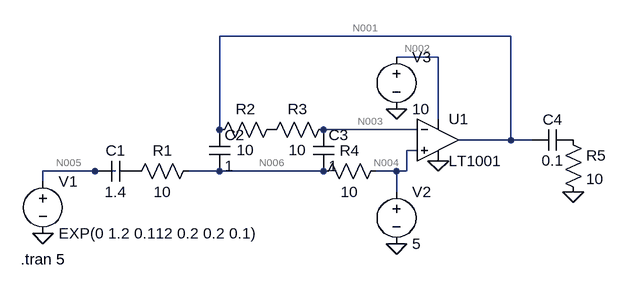
[diagram p0: schematic neural pulse very_close_approx_!_1009.asc]
neural pulse very_close_approx_!_1009.asc, the LTspice schematic file:
Version 4
SHEET 1 880 680
WIRE 432 -128 -16 -128
WIRE 320 -96 256 -96
WIRE 320 0 320 -96
WIRE -16 16 -16 -128
WIRE 288 16 144 16
WIRE 432 32 432 -128
WIRE 432 32 352 32
WIRE 464 32 432 32
WIRE 288 48 272 48
WIRE -208 80 -288 80
WIRE -176 80 -208 80
WIRE -16 80 -64 80
WIRE 144 80 -16 80
WIRE 256 80 224 80
WIRE 272 80 272 48
WIRE 272 80 256 80
WIRE -288 96 -288 80
WIRE 256 112 256 80
FLAG -288 176 0
FLAG 256 192 0
FLAG 320 64 0
FLAG 256 -16 0
FLAG 528 112 0
SYMBOL voltage -288 80 R0
WINDOW 123 0 0 Left 2
WINDOW 39 0 0 Left 2
SYMATTR InstName V1
SYMATTR Value EXP(0 1.2 0.112 0.2 0.2 0.1)
SYMBOL cap -144 64 R90
WINDOW 0 0 32 VBottom 2
WINDOW 3 32 32 VTop 2
SYMATTR InstName C1
SYMATTR Value 1.4
SYMBOL res -48 64 R90
WINDOW 0 0 56 VBottom 2
WINDOW 3 32 56 VTop 2
SYMATTR InstName R1
SYMATTR Value 10
SYMBOL cap -32 16 R0
SYMATTR InstName C2
SYMATTR Value 1
SYMBOL res 80 0 R90
WINDOW 0 0 56 VBottom 2
WINDOW 3 32 56 VTop 2
SYMATTR InstName R2
SYMATTR Value 10
SYMBOL res 160 0 R90
WINDOW 0 0 56 VBottom 2
WINDOW 3 32 56 VTop 2
SYMATTR InstName R3
SYMATTR Value 10
SYMBOL cap 128 16 R0
SYMATTR InstName C3
SYMATTR Value 1
SYMBOL res 240 64 R90
WINDOW 0 0 56 VBottom 2
WINDOW 3 32 56 VTop 2
SYMATTR InstName R4
SYMATTR Value 10
SYMBOL voltage 256 96 R0
WINDOW 123 0 0 Left 2
WINDOW 39 0 0 Left 2
SYMATTR InstName V2
SYMATTR Value 5
SYMBOL Opamps\\LT1001 320 -32 R0
SYMATTR InstName U1
SYMBOL voltage 256 -112 R0
WINDOW 123 0 0 Left 2
WINDOW 39 0 0 Left 2
SYMATTR InstName V3
SYMATTR Value 10
SYMBOL cap 528 16 R90
WINDOW 0 0 32 VBottom 2
WINDOW 3 32 32 VTop 2
SYMATTR InstName C4
SYMATTR Value 0.1
SYMBOL res 512 16 R0
SYMATTR InstName R5
SYMATTR Value 10
TEXT -322 216 Left 2 !.tran 5

The netlist it stands for:
* neural pulse very_close_approx_!_1009.asc
V1 N005 0 EXP(0 1.2 0.112 0.2 0.2 0.1)
C1 P001 N005 1.4
R1 N006 P001 10
C2 N001 N006 1
R2 P002 N001 10
R3 N003 P002 10
C3 N003 N006 1
R4 N004 N006 10
V2 N004 0 5
XU1 N004 N003 N002 0 N001 LT1001  ; pins In+ In- V+ V- OUT
V3 N002 0 10
C4 P003 N001 0.1
R5 P003 0 10
.tran 5
.lib LTC.lib
.backanno
.end

* Results of the author's LTspice run, read from the files saved beside the schematic
* Operating Point, zero values left out:
*   V(p001) = 5 V
*   V(n006) = 5 V
*   V(n001) = 5 V
*   V(p002) = 5 V
*   V(n003) = 5 V
*   V(n004) = 5 V
*   V(n002) = 10 V
*   I(C1) = 7 pA
*   I(R4) = 7 pA
*   I(R1) = 7 pA
*   I(V3) = -2.25 mA
*   I(V2) = -7.001 pA
*   I(V1) = 7 pA
*   Ix(u1:3) = 2.25 mA
*   Ix(u1:4) = -2.25 mA
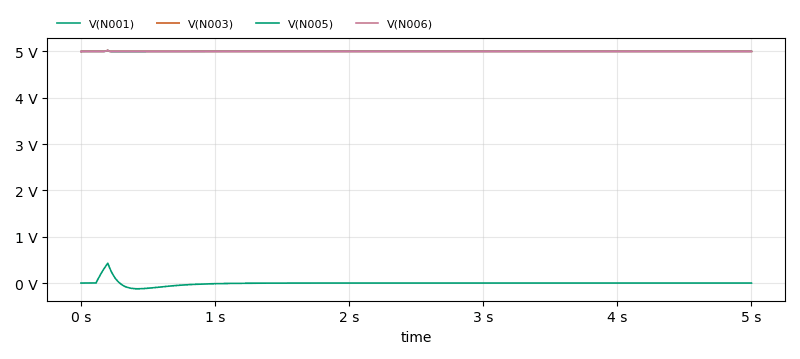
[diagram p1: Transient Analysis of neural pulse very_close_approx_!_1009.asc, plotted from the saved traces]
* Transient Analysis, 1 run:
*   V(N001): min 4.997 V, max 5.021 V, average 5.001 V, rms 5.001 V, last 5.001 V
*   V(N003): min 5 V, max 5.023 V, average 5 V, rms 5 V, last 5 V
*   V(N005): min -124.3 mV, max 427.2 mV, average -2.874 mV, rms 53.01 mV, last 0 V
*   V(N006): min 5 V, max 5.023 V, average 5 V, rms 5 V, last 5 V